# EAGLE design UsbSwitch (EAGLE 7.4.0)
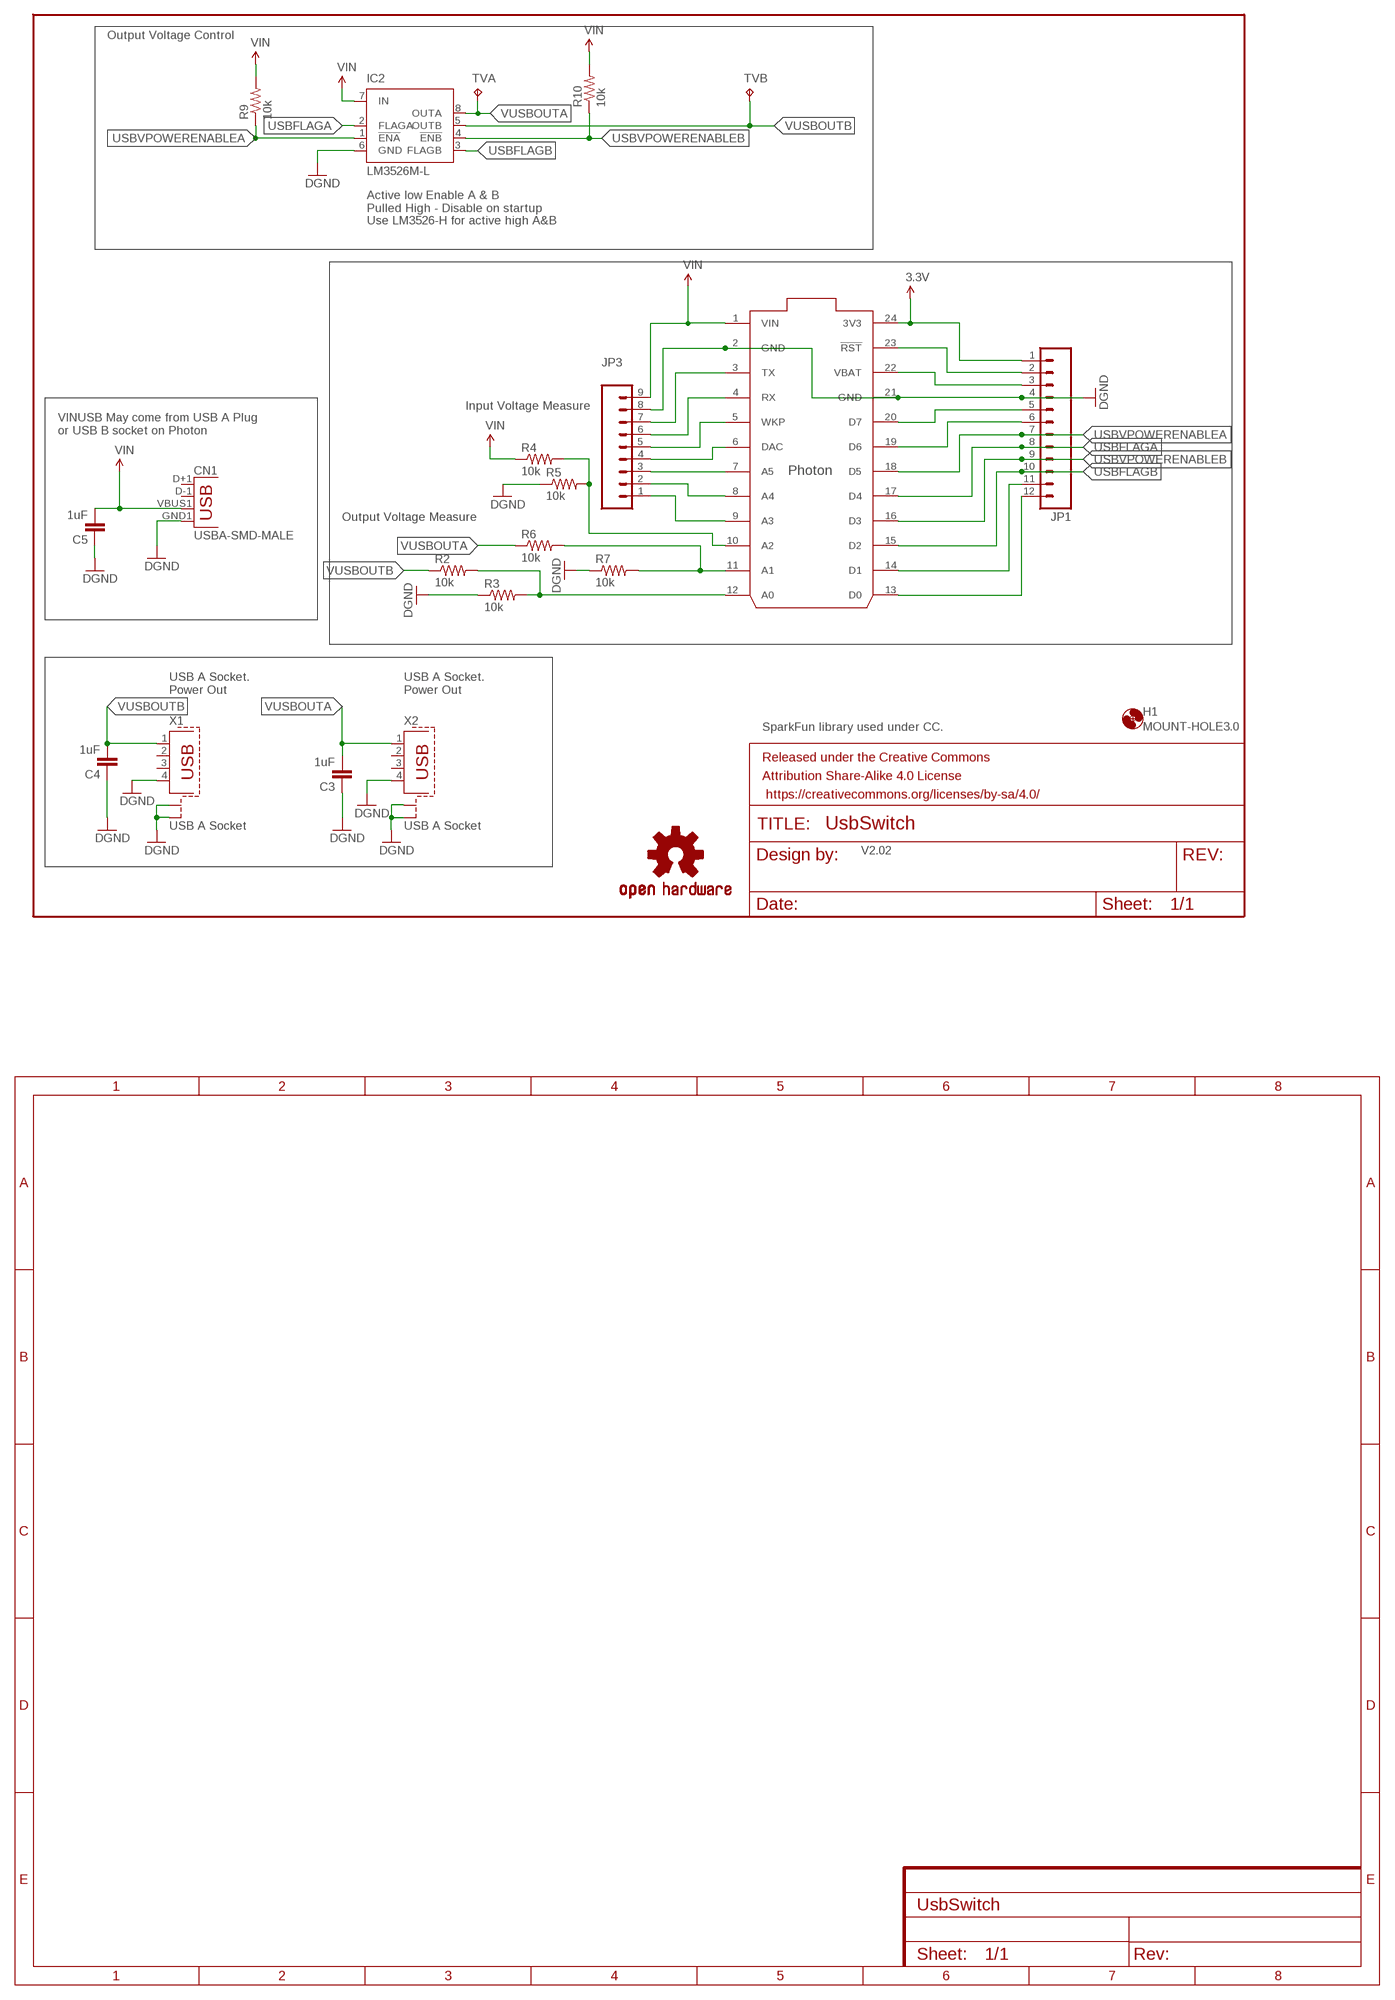
[diagram p0: schematic, sheet 1]

## Parts
C3  1uF  CAP0805  [0805]
C4  1uF  CAP0805  [0805]
C5  1uF  CAP0805  [0805]
CN1  USBA-SMD-MALE  [USB-A-SMT-MALE]
FRAME2  FRAME-LETTER  [CREATIVE_COMMONS]
H1  MOUNT-HOLE3.0  [3,0]
IC1  PHOTON  PHOTON_WITH_HEADERS  [PHOTON]
IC2  LM3526M-L  [SO08]
JP1  M12PTH  [1X12]
JP3  M09  [1X09]
LOGO2  OSHW-LOGOM  [OSHW-LOGO-M]
R2  10k  RESISTOR1206  [1206]
R3  10k  RESISTOR1206  [1206]
R4  10k  RESISTOR1206  [1206]
R5  10k  RESISTOR1206  [1206]
R6  10k  RESISTOR1206  [1206]
R7  10k  RESISTOR1206  [1206]
R9  10k  RESISTOR1206  [1206]
R10  10k  RESISTOR1206  [1206]
TVA  TPTP20SQ  [TP20SQ]
TVB  TPTP20SQ  [TP20SQ]
X1  USB A Socket  PN87520-S  [PN87520-S]
X2  USB A Socket  PN87520-S  [PN87520-S]

## Nets
3.3V: IC1.24(3V3) JP1.1
GND: C3.1 C4.1 C5.1 CN1.GND1(GND) IC1.2(GND) IC1.21(GND) IC2.6(GND) JP1.4 JP3.8 R3.1 R5.1 R7.1 X1.4 X1.S1 X1.S2 X2.4 X2.S1 X2.S2 ; supply symbol labelled DGND
N$1: IC1.6(DAC) JP3.4
N$3: IC1.5(WKP) JP3.5
N$4: IC1.4(RX) JP3.6
N$5: IC1.11(A1) R6.2 R7.2
N$6: IC1.9(A3) JP3.1
N$7: IC1.8(A4) JP3.2
N$11: IC1.7(A5) JP3.3
N$12: IC1.19(D6) JP1.6
N$13: IC1.20(D7) JP1.5
N$14: IC1.22(VBAT) JP1.3
N$15: IC1.23(!RST) JP1.2
N$16: IC1.3(TX) JP3.7
N$21: IC1.12(A0) R2.2 R3.2
N$23: IC1.10(A2) R4.2 R5.2
SCL/SWITCH2: IC1.14(D1) JP1.11
SDA/SWITCH1: IC1.13(D0) JP1.12
USBFLAGA: IC1.17(D4) IC2.2(FLAGA) JP1.8
USBFLAGB: IC1.15(D2) IC2.3(FLAGB) JP1.10
USBVPOWERENABLEA: IC1.18(D5) IC2.1(!ENA) JP1.7 R9.1
USBVPOWERENABLEB: IC1.16(D3) IC2.4(!ENB) JP1.9 R10.1
VIN: C5.2 CN1.VBUS1(VBUS) IC1.1(VIN) IC2.7(IN) JP3.9 R4.1 R9.2 R10.2
VUSBOUTA: C3.2 IC2.8(OUTA) R6.1 TVA.TP X2.1
VUSBOUTB: C4.2 IC2.5(OUTB) R2.1 TVB.TP X1.1
Unconnected: CN1.D+1(D+) CN1.D-1(D-) X1.2 X1.3 X2.2 X2.3

## Notes on the sheet
- Output Voltage Control
- Active low Enable A & B
  Pulled High - Disable on startup
- Use LM3526-H for active high A&B
- Input Voltage Measure
- VINUSB May come from USB A Plug 
  or USB B socket on Photon
- Output Voltage Measure
- USB A Socket.
  Power Out
- USB A Socket.
  Power Out
- SparkFun library used under CC.
- V2.02

## Library data of the parts
C3-C5 = SparkFun-Passives:CAP: Capacitor Standard 0603 ceramic capacitor, and 0.1" leaded capacitor.
CN1 = SparkFun-Connectors:USB: USB Connectors USB-B-PTH is fully proven SKU : PRT-00139/CONN-08278 USB-miniB is fully proven SKU : PRT-00587 USB-A-PCB is untested. USB-A-H is throughly reviewed, but untested. Spark Fun Electronics SKU : PRT-00437 USB-B-SMT is throughly reviewed, but untested. Needs silkscreen touching up. USB-A-S has not been used/tested USB-MB-H has not been used/tested USB-MICROB has been used. CONN-09505
FRAME2 = SparkFun-Aesthetics:FRAME-LETTER: Schematic Frame Standard 8.5x11 US Letter frame
H1 = holes:MOUNT-HOLE: MOUNTING HOLE with drill center marker
IC1 = Spark:PHOTON
IC2 = SH-linear:LM3526M-L: Dual Port USB Power Switch and Over-Current Protection LOW active
JP1 = SparkFun-Connectors:M12: Header 12 Standard 12-pin 0.1" header. Use with straight break away headers (SKU : PRT-00116), right angle break away headers (PRT-00553), swiss pins (PRT-00743), machine pins (PRT-00117), and female headers (PRT-00115).
JP3 = SparkFun-Connectors:M09: Header 9 Standard 9-pin 0.1" header. Use with straight break away headers (SKU : PRT-00116), right angle break away headers (PRT-00553), swiss pins (PRT-00743), machine pins (PRT-00117), and female headers (PRT-00115).
LOGO2 = SparkFun-Aesthetics:OSHW-LOGO: Open Source Hardware Logo This logo indicates the piece of hardware it is found on incorporates a OSHW license and/or adheres to the definition of open source hardware found here: http://freedomdefined.org/OSHW
R2-R7 R9 R10 = SparkFun-Passives:RESISTOR: Resistor Basic schematic elements and footprints for 0603, 1206, and PTH resistors.
TVA TVB = testpad:TP: Test pad
X1 X2 = con-berg:PN87520-S; OC_FARNELL: unknown; OC_NEWARK: unknown

## Board
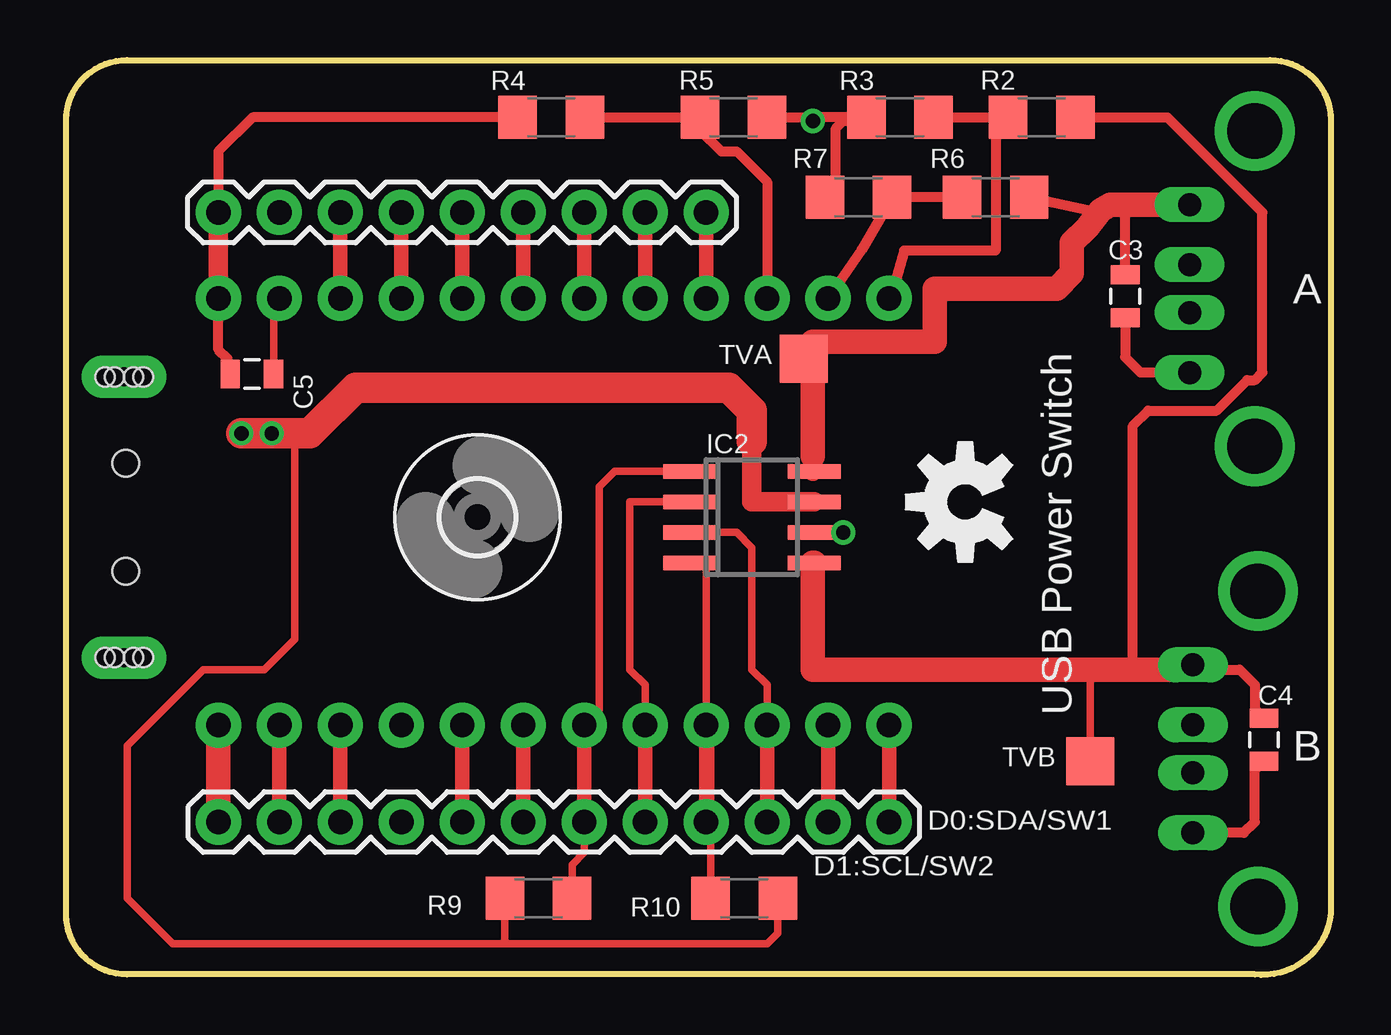
[diagram p1: board, top side]
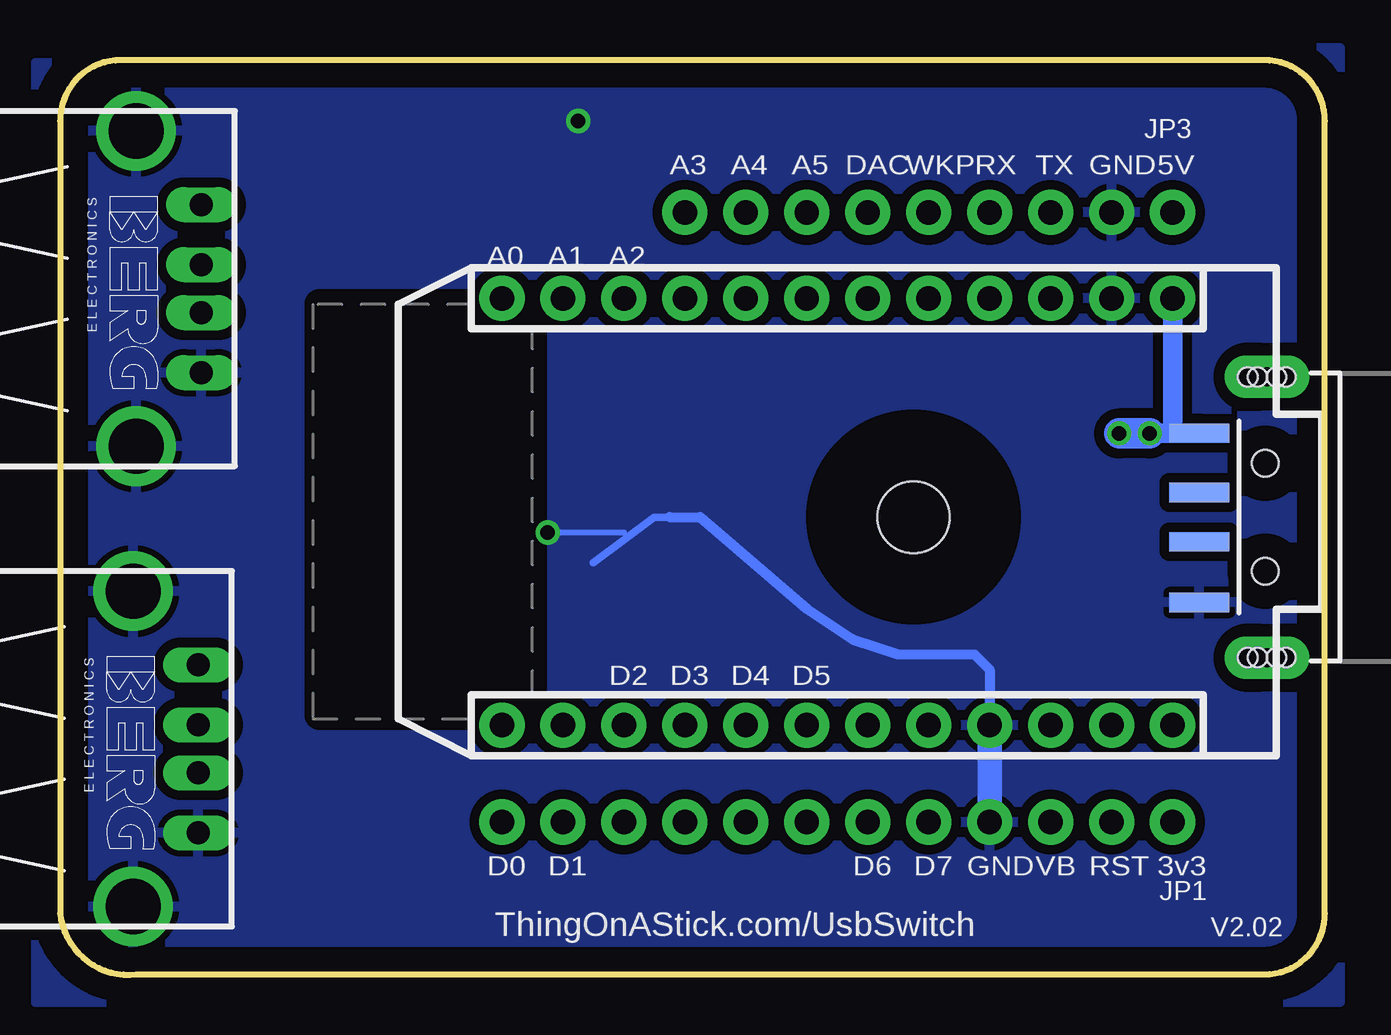
[diagram p2: board, bottom side, seen from below]

Size 52.71 x 38.12 mm. Coordinates in mm from the lower left corner, seen from the top.
Outline: 0,2.56 0,35.58 arc-90 2.54,38.12 50.16,38.12 arc-90 52.71,35.58 52.71,2.56 arc-90 49.53,0.02 2.54,0.02 arc-90 0,2.56
Copper layers (1*16): Top 0.035mm / dielectric 1.5mm / Bottom 0.035mm
Design rules "default": minimum track width 10mil, minimum drill 24mil, track to track 8mil, track to pad 8mil, pad to pad 8mil, via to via 8mil, smd to smd 8mil, copper to edge 40mil, drill to drill 8mil, minimum pad ring 10mil, minimum via ring 8mil, stop-mask expansion 4mil, vias tented up to drill 0mil, thermal gap 10mil
tRestrict: area 33,10.8 to 41.9,28
bRestrict: area 33,10.8 to 41.9,28

### Footprints (pad centres in the part's own frame; a part is rotated, then mirrored left to right if it is on the bottom)
0805 = smd 0.8 x 1.2: 1 -0.9,0; 2 0.9,0
USB-A-SMT-MALE = smd 0.8 x 2.5: D+1 1.027,-5.87; D-1 -1.027,-5.87; GND1 3.551,-5.87; VBUS1 -3.5,-5.87 | drill 0.8 pad 1.778 long: P$1 5.85,-3.05; P$3 -5.85,-3.05 | hole 1.1: 2.25,-3.12; -2.25,-3.12 | hole 0.8: -5.85,-3.45; -5.85,-3.85; -5.85,-2.65; -5.85,-2.25; 5.85,-3.45; 5.85,-3.85; 5.85,-2.65; 5.85,-2.25
3,0 = hole 3: 0,0
PHOTON = drill 1.016 pad 1.88: 1 1.27,32.258; 2 1.27,29.718; 3 1.27,27.178; 4 1.27,24.638; 5 1.27,22.098; 6 1.27,19.558; 7 1.27,17.018; 8 1.27,14.478; 9 1.27,11.938; 10 1.27,9.398; 11 1.27,6.858; 12 1.27,4.318; 13 19.05,4.318; 14 19.05,6.858; 15 19.05,9.398; 16 19.05,11.938; 17 19.05,14.478; 18 19.05,17.018; 19 19.05,19.558; 20 19.05,22.098; 21 19.05,24.638; 22 19.05,27.178; 23 19.05,29.718; 24 19.05,32.258
SO08 = smd 0.6 x 2.2: 1 -1.905,-2.6; 2 -0.635,-2.6; 3 0.635,-2.6; 4 1.905,-2.6; 5 1.905,2.6; 6 0.635,2.6; 7 -0.635,2.6; 8 -1.905,2.6
1X12 = drill 1.016 pad 1.88: 1 0,0; 2 2.54,0; 3 5.08,0; 4 7.62,0; 5 10.16,0; 6 12.7,0; 7 15.24,0; 8 17.78,0; 9 20.32,0; 10 22.86,0; 11 25.4,0; 12 27.94,0
1X09 = drill 1.016 pad 1.88: 1 0,0; 2 2.54,0; 3 5.08,0; 4 7.62,0; 5 10.16,0; 6 12.7,0; 7 15.24,0; 8 17.78,0; 9 20.32,0
1206 = smd 1.6 x 1.8: 1 -1.4,0; 2 1.4,0
TP20SQ = smd 2 x 2: TP 0,0
PN87520-S = drill 0.95 long: 1 -3.5,2.71; 2 -1,2.71; 3 1,2.71; 4 3.5,2.71 | drill 2.3 pad 2.9: S1 -6.57,0; S2 6.57,0

### Placement (x,y rotation side)
C3  44.13,28.27 90 top
C4  49.91,9.8 90 top
C5  7.75,25.04 180 top
CN1  -0.64,19.07 270 bottom
FRAME2  -13.33,-26.02 0 top  (outside the outline)
H1  17.14,19.07 0 top
IC1  38.61,29.46 270 bottom
IC2  28.57,19.07 270 top
JP1  6.35,6.37 0 top
JP3  26.67,31.77 180 top
LOGO2  37.47,19.7 90 top
R2  40.65,35.73 180 top
R3  34.75,35.73 0 top
R4  20.22,35.73 0 top
R5  27.81,35.73 180 top
R6  38.73,32.4 180 top
R7  33.02,32.4 0 top
R9  19.68,3.19 180 top
R10  28.26,3.19 0 top
TVA  30.73,25.67 0 top
TVB  42.67,8.91 0 top
X1  49.66,9.42 270 bottom
X2  49.53,28.59 270 bottom

### Tracks (layer width: path | path; a pad name or v marks a point on that pad's centre or on a via)
3.3V
  Top 1.016: IC1.24 JP1.1
GND  (via drill 0.6)
  Top 0.305: C5.1 8.65,27.94 IC1.2
  Top 0.406: C4.1 49.53,8.52 49.53,6.37 49.08,5.92 X1.4 | R7.1 32.08,31.95 32.08,35.27 32.39,35.58 33.2,35.58 R3.1 31.27,35.73 v31.11,35.58 30.96,35.73 R5.1 | C3.1 44.13,25.73 44.77,25.1 X2.4 | 9.28,27.79 IC1.2
  Top 0.61: IC2.6 v32.39,18.43
  Bottom 0.254: v32.39,18.43 29.21,18.43
  Bottom 0.305: 27.3,19.07 27.94,19.07 30.48,17.16 | X2.4 47.32,25.09 47.62,24.78 47.31,24.78 46.99,25.1
  Bottom 0.406: 27.3,19.07 26.04,19.07 21.59,15.26 19.68,13.99 17.78,13.35 14.61,13.35 13.97,12.72 IC1.21 13.97,10.18
  Bottom 1.016: JP1.4 IC1.21
  pour Bottom (isolate 0.406): -0.64,38.63 53.72,37.99 53.72,-1.13 -0.64,-1.13
N$1
  Top 0.61: JP3.4 IC1.6
N$3
  Top 0.61: JP3.5 IC1.5
N$4
  Top 0.61: JP3.6 IC1.4
N$5
  Top 0.406: R6.2 R7.2 33.15,30.22 IC1.11
N$6
  Top 0.61: IC1.9 JP3.1
N$7
  Top 0.61: IC1.8 JP3.2
N$11
  Top 0.61: IC1.7 JP3.3
N$12
  Top 0.61: JP1.6 IC1.19
N$13
  Top 0.61: JP1.5 IC1.20
N$14
  Top 0.61: JP1.3 IC1.22
N$15
  Top 0.61: JP1.2 IC1.23
N$16
  Top 0.61: JP3.7 IC1.3
N$21
  Top 0.406: R3.2 R2.2 38.73,35.7 | 38.73,35.7 38.62,35.69 | IC1.12 34.38,28.28 34.93,30.18 38.73,30.18 38.73,35.69 38.73,35.7
N$23
  Top 0.406: IC1.10 29.21,33.04 27.94,34.31 27.3,34.31 26.41,35.2 R5.2 R4.2
SCL/SWITCH2
  Top 0.61: JP1.11 IC1.14
SDA/SWITCH1
  Top 0.61: JP1.12 IC1.13
USBFLAGA
  Top 0.305: IC1.17 24.13,12.08 23.49,12.72 23.49,19.7 IC2.2
  Top 0.61: JP1.8 IC1.17
USBFLAGB
  Top 0.305: IC2.3 27.94,18.43 28.57,17.8 28.57,12.72 29.21,12.08 IC1.15
  Top 0.61: JP1.10 IC1.15
USBVPOWERENABLEA
  Top 0.254: IC2.1 25.4,20.97
  Top 0.305: 25.4,20.97 22.86,20.97 22.22,20.34 22.22,11.04 IC1.18 | R9.1 21.08,4.59 21.59,5.1 JP1.7
  Top 0.61: JP1.7 IC1.18
USBVPOWERENABLEB
  Top 0.305: IC2.4 26.67,17.16 IC1.16 26.86,10.22 R10.1
  Top 0.61: JP1.9 IC1.16
VIN  (via drill 0.6)
  Top 0.305: R10.2 29.66,1.73 29.21,1.29 18.41,1.29 | 18.41,1.29 4.45,1.29 2.54,3.19 2.54,9.54 5.71,12.72 8.26,12.72 9.53,13.99 9.53,22.56 | R9.2 18.29,1.42 18.41,1.29
  Top 0.406: R4.1 7.77,35.73 6.35,34.31 JP3.9 | IC1.1 6.35,26.05 6.73,25.67 C5.2
  Top 0.813: IC2.7 28.57,19.7 28.57,22.24 | IC1.1 JP3.9
  Top 1.27: v8.57,22.56 v8.56,22.57 v7.31,22.57 v7.3,22.56 v8.57,22.56 | v8.57,22.56 9.53,22.56 10.16,22.56 12.06,24.47 27.62,24.47 28.57,23.51 28.57,22.24
  Bottom 0.813: IC1.1 6.35,22.57 CN1.VBUS1 v7.29,22.57 v7.3,22.56
  Bottom 1.27: v7.3,22.56 v8.57,22.56
VUSBOUTA
  Top 0.406: 47.13,32.4 X2.1 | C3.2 44.13,31.78 44.45,32.09 | R6.1 43.03,31.77 43.12,31.86
  Top 0.61: IC2.8 31.11,20.97
  Top 0.813: 31.11,20.97 31.11,21.61
  Top 1.016: 31.11,21.61 31.11,26.05 | X2.1 44.45,32.09 43.51,32.09 43.12,31.86 42.55,31.13 41.91,30.5 41.91,29.23 41.27,28.59 36.2,28.59 36.2,26.37 31.11,26.37 31.11,26.05 | 31.11,26.05 TVA.TP
VUSBOUTB
  Top 0.305: TVB.TP 42.67,12.59 42.55,12.72
  Top 0.406: 46.99,12.72 47.15,12.72 | 47.15,12.72 X1.1 | 47.15,12.72 48.9,12.72 49.53,12.08 49.53,11.08 C4.2 | 44.45,12.72 44.45,22.88 45.09,23.51 47.94,23.51 49.21,24.78 49.53,24.78 49.85,25.1 49.85,31.77 45.89,35.73 R2.1
  Top 1.016: IC2.5 31.11,17.16 31.11,12.72 42.55,12.72 44.45,12.72 46.75,12.72 X1.1 46.71,13.15

### Text on the board
tNames: A | USB Power Switch | B | D0:SDA/SW1 | D1:SCL/SW2 | GND
bNames: 5V | GND | TX | RX | WKP | DAC | A5 | A4 | A3 | A2 | A1 | A0 | D5 | D4 | D3 | D2 | 3v3 | RST | VB | GND | D7 | D6 | D1 | D0 | V2.02 | ThingOnAStick.com/UsbSwitch